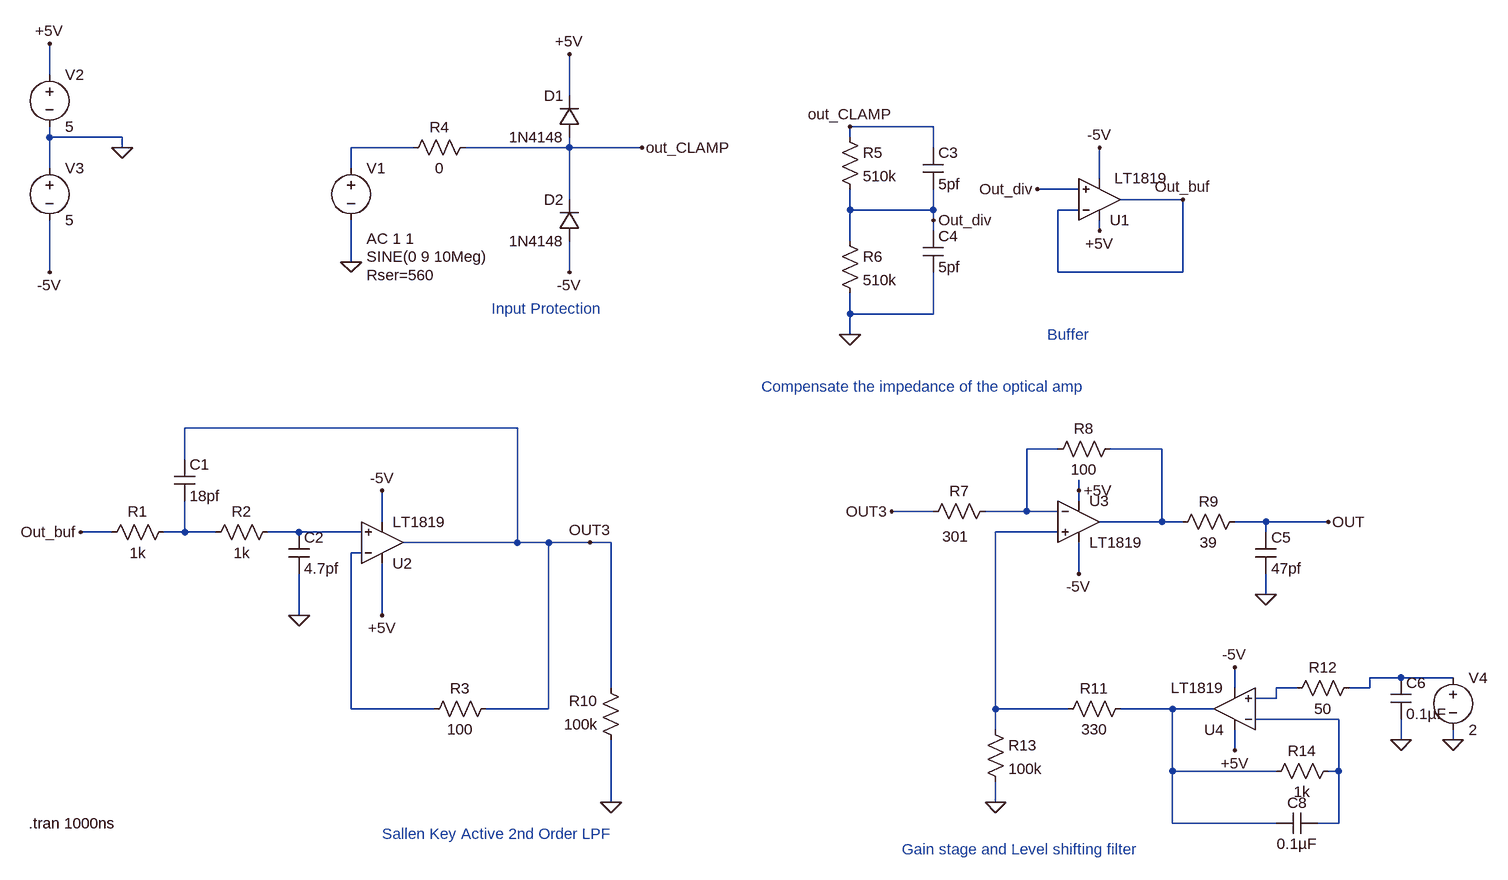
[diagram p0: schematic GOODSC_2.asc]
GOODSC_2.asc, the LTspice schematic file:
Version 4
SHEET 1 1116 2168
WIRE -1872 960 -1872 912
WIRE -1072 992 -1072 928
WIRE -512 1040 -640 1040
WIRE -1872 1056 -1872 1040
WIRE -1760 1056 -1872 1056
WIRE -640 1056 -640 1040
WIRE -1760 1072 -1760 1056
WIRE -1312 1072 -1408 1072
WIRE -1072 1072 -1072 1056
WIRE -1072 1072 -1232 1072
WIRE -960 1072 -1072 1072
WIRE -512 1072 -512 1040
WIRE -1872 1104 -1872 1056
WIRE -1408 1104 -1408 1072
WIRE -256 1120 -256 1072
WIRE -288 1136 -352 1136
WIRE -1072 1152 -1072 1072
WIRE -128 1152 -224 1152
WIRE -640 1168 -640 1136
WIRE -512 1168 -512 1136
WIRE -512 1168 -640 1168
WIRE -288 1168 -320 1168
WIRE -512 1184 -512 1168
WIRE -512 1200 -512 1184
WIRE -256 1200 -256 1184
WIRE -640 1216 -640 1168
WIRE -1408 1248 -1408 1184
WIRE -1872 1264 -1872 1184
WIRE -1072 1264 -1072 1216
WIRE -320 1264 -320 1168
WIRE -128 1264 -128 1152
WIRE -128 1264 -320 1264
WIRE -640 1328 -640 1296
WIRE -512 1328 -512 1264
WIRE -512 1328 -640 1328
WIRE -640 1360 -640 1328
WIRE -1152 1504 -1664 1504
WIRE -320 1536 -368 1536
WIRE -160 1536 -240 1536
WIRE -1664 1552 -1664 1504
WIRE -288 1600 -288 1584
WIRE -288 1616 -288 1600
WIRE -512 1632 -576 1632
WIRE -368 1632 -368 1536
WIRE -368 1632 -432 1632
WIRE -320 1632 -368 1632
WIRE -1360 1648 -1360 1600
WIRE -160 1648 -160 1536
WIRE -160 1648 -256 1648
WIRE -128 1648 -160 1648
WIRE 0 1648 -48 1648
WIRE 96 1648 0 1648
WIRE -1776 1664 -1824 1664
WIRE -1664 1664 -1664 1616
WIRE -1664 1664 -1696 1664
WIRE -1616 1664 -1664 1664
WIRE -1488 1664 -1536 1664
WIRE -1392 1664 -1488 1664
WIRE -320 1664 -416 1664
WIRE 0 1664 0 1648
WIRE -1152 1680 -1152 1504
WIRE -1152 1680 -1328 1680
WIRE -1104 1680 -1152 1680
WIRE -1040 1680 -1104 1680
WIRE -1008 1680 -1040 1680
WIRE -1392 1696 -1408 1696
WIRE -288 1728 -288 1680
WIRE 0 1760 0 1728
WIRE -1488 1792 -1488 1728
WIRE -1360 1792 -1360 1712
WIRE 208 1888 160 1888
WIRE 288 1888 208 1888
WIRE -1008 1904 -1008 1680
WIRE -48 1904 -48 1872
WIRE 48 1904 16 1904
WIRE 160 1904 160 1888
WIRE 160 1904 128 1904
WIRE 16 1920 16 1904
WIRE 16 1920 -16 1920
WIRE -1408 1936 -1408 1696
WIRE -1280 1936 -1408 1936
WIRE -1104 1936 -1104 1680
WIRE -1104 1936 -1200 1936
WIRE -416 1936 -416 1664
WIRE -304 1936 -416 1936
WIRE -144 1936 -224 1936
WIRE -80 1936 -144 1936
WIRE 112 1952 -16 1952
WIRE -416 1968 -416 1936
WIRE 208 1984 208 1952
WIRE 288 1984 288 1968
WIRE -48 2000 -48 1968
WIRE -144 2032 -144 1936
WIRE 16 2032 -144 2032
WIRE 112 2032 112 1952
WIRE 112 2032 96 2032
WIRE -1008 2080 -1008 1984
WIRE -416 2080 -416 2048
WIRE -144 2112 -144 2032
WIRE 16 2112 -144 2112
WIRE 112 2112 112 2032
WIRE 112 2112 80 2112
FLAG -1760 1072 0
FLAG -1872 912 +5V
FLAG -1872 1264 -5V
FLAG -1488 1792 0
FLAG -1008 2080 0
FLAG -1360 1600 -5V
FLAG -1360 1792 +5V
FLAG -1040 1680 OUT3
FLAG -1408 1248 0
FLAG -1072 928 +5V
FLAG -1072 1264 -5V
FLAG -960 1072 out_CLAMP
FLAG -640 1040 out_CLAMP
FLAG -512 1184 Out_div
FLAG -352 1136 Out_div
FLAG -128 1152 Out_buf
FLAG -256 1072 -5V
FLAG -256 1200 +5V
FLAG -416 2080 0
FLAG 208 1984 0
FLAG 288 1984 0
FLAG 0 1760 0
FLAG 96 1648 OUT
FLAG -288 1600 +5V
FLAG -288 1728 -5V
FLAG -48 1872 -5V
FLAG -48 2000 +5V
FLAG -640 1360 0
FLAG -1824 1664 Out_buf
FLAG -576 1632 OUT3
DATAFLAG -144 1648 ""
SYMBOL voltage -1872 944 R0
WINDOW 123 0 0 Left 2
WINDOW 39 0 0 Left 2
SYMATTR InstName V2
SYMATTR Value 5
SYMBOL voltage -1872 1088 R0
WINDOW 123 0 0 Left 2
WINDOW 39 0 0 Left 2
SYMATTR InstName V3
SYMATTR Value 5
SYMBOL res -1680 1648 R90
WINDOW 0 0 56 VBottom 2
WINDOW 3 32 56 VTop 2
SYMATTR InstName R1
SYMATTR Value 1k
SYMBOL res -1520 1648 R90
WINDOW 0 0 56 VBottom 2
WINDOW 3 32 56 VTop 2
SYMATTR InstName R2
SYMATTR Value 1k
SYMBOL res -992 2000 R180
WINDOW 0 36 76 Left 2
WINDOW 3 36 40 Left 2
SYMATTR InstName R10
SYMATTR Value 100k
SYMBOL res -1296 1952 R270
WINDOW 0 32 56 VTop 2
WINDOW 3 0 56 VBottom 2
SYMATTR InstName R3
SYMATTR Value 100
SYMBOL Opamps\\LT1819 -1360 1680 M180
SYMATTR InstName U2
SYMBOL cap -1504 1664 R0
SYMATTR InstName C2
SYMATTR Value 4.7pf
SYMBOL cap -1680 1552 R0
SYMATTR InstName C1
SYMATTR Value 18pf
SYMBOL voltage -1408 1088 R0
WINDOW 3 24 152 Left 2
WINDOW 123 24 124 Left 2
WINDOW 39 24 180 Left 2
SYMATTR Value SINE(0 9 10Meg)
SYMATTR Value2 AC 1 1
SYMATTR SpiceLine Rser=560
SYMATTR InstName V1
SYMBOL res -1216 1056 R90
WINDOW 0 0 56 VBottom 2
WINDOW 3 32 56 VTop 2
SYMATTR InstName R4
SYMATTR Value 0
SYMBOL diode -1056 1056 R180
WINDOW 0 24 64 Left 2
WINDOW 3 24 0 Left 2
SYMATTR InstName D1
SYMATTR Value 1N4148
SYMBOL diode -1056 1216 R180
WINDOW 0 24 64 Left 2
WINDOW 3 24 0 Left 2
SYMATTR InstName D2
SYMATTR Value 1N4148
SYMBOL res -656 1040 R0
SYMATTR InstName R5
SYMATTR Value 510k
SYMBOL res -656 1200 R0
SYMATTR InstName R6
SYMATTR Value 510k
SYMBOL cap -528 1072 R0
SYMATTR InstName C3
SYMATTR Value 5pf
SYMBOL cap -528 1200 R0
SYMATTR InstName C4
SYMATTR Value 5pf
SYMBOL Opamps\\LT1819 -256 1152 M180
WINDOW 3 23 33 Left 2
SYMATTR InstName U1
SYMBOL res -416 1616 R90
WINDOW 0 0 56 VBottom 2
WINDOW 3 39 62 VTop 2
SYMATTR InstName R7
SYMATTR Value 301
SYMBOL res -224 1520 R90
WINDOW 0 0 56 VBottom 2
WINDOW 3 32 56 VTop 2
SYMATTR InstName R8
SYMATTR Value 100
SYMBOL res -32 1632 R90
WINDOW 0 0 56 VBottom 2
WINDOW 3 32 56 VTop 2
SYMATTR InstName R9
SYMATTR Value 39
SYMBOL res -208 1920 R90
WINDOW 0 0 56 VBottom 2
WINDOW 3 32 56 VTop 2
SYMATTR InstName R11
SYMATTR Value 330
SYMBOL res 144 1888 R90
WINDOW 0 0 56 VBottom 2
WINDOW 3 32 56 VTop 2
SYMATTR InstName R12
SYMATTR Value 50
SYMBOL res -432 1952 R0
SYMATTR InstName R13
SYMATTR Value 100k
SYMBOL Opamps\\LT1819 -288 1648 R0
SYMATTR InstName U3
SYMBOL Opamps\\LT1819 -48 1936 R180
SYMATTR InstName U4
SYMBOL cap -16 1664 R0
SYMATTR InstName C5
SYMATTR Value 47pf
SYMBOL cap 192 1888 R0
SYMATTR InstName C6
SYMATTR Value 0.1µF
SYMBOL cap 80 2096 R90
WINDOW 0 0 32 VBottom 2
WINDOW 3 32 32 VTop 2
SYMATTR InstName C8
SYMATTR Value 0.1µF
SYMBOL res 112 2016 R90
WINDOW 0 0 56 VBottom 2
WINDOW 3 32 56 VTop 2
SYMATTR InstName R14
SYMATTR Value 1k
SYMBOL voltage 288 1872 R0
WINDOW 123 0 0 Left 2
WINDOW 39 0 0 Left 2
SYMATTR InstName V4
SYMATTR Value 2
TEXT -1360 2128 Left 2 ;Sallen Key Active 2nd Order LPF
TEXT -1192 1320 Left 2 ;Input Protection
TEXT -1904 2112 Left 2 !.tran 1000ns
TEXT -336 1360 Left 2 ;Buffer
TEXT -560 2152 Left 2 ;Gain stage and Level shifting filter
TEXT -776 1440 Left 2 ;Compensate the impedance of the optical amp

The netlist it stands for:
* GOODSC_2.asc
V2 +5V 0 5
V3 0 -5V 5
R1 N004 Out_buf 1k
R2 N005 N004 1k
R10 0 OUT3 100k
R3 N007 OUT3 100
* U2: LT1819 (symbol Opamps\LT1819 not available, pins judged from their places): In+=N005 In-=N007 V+=+5V V-=-5V OUT=OUT3
C2 N005 0 4.7pf
C1 OUT3 N004 18pf
V1 N001 0 SINE(0 9 10Meg) AC 1 1 Rser=560
R4 out_CLAMP N001 0
D1 out_CLAMP +5V 1N4148
D2 -5V out_CLAMP 1N4148
R5 out_CLAMP Out_div 510k
R6 Out_div 0 510k
C3 out_CLAMP Out_div 5pf
C4 Out_div 0 5pf
* U1: LT1819 (symbol Opamps\LT1819 not available, pins judged from their places): In+=Out_div In-=Out_buf V+=+5V V-=-5V OUT=Out_buf
R7 N002 OUT3 301
R8 N003 N002 100
R9 OUT N003 39
R11 N010 N006 330
R12 N008 N009 50
R13 N006 0 100k
* U3: LT1819 (symbol Opamps\LT1819 not available, pins judged from their places): In+=N006 In-=N002 V+=+5V V-=-5V OUT=N003
* U4: LT1819 (symbol Opamps\LT1819 not available, pins judged from their places): In+=N009 In-=N011 V+=+5V V-=-5V OUT=N010
C5 OUT 0 47pf
C6 N008 0 0.1µF
C8 N011 N010 0.1µF
R14 N011 N010 1k
V4 N008 0 2
.model D D
.lib standard.dio
* Sallen Key Active 2nd Order LPF
* Input Protection
.tran 1000ns
* Buffer
* Gain stage and Level shifting filter
* Compensate the impedance of the optical amp
.backanno
.end